# Altium schematic sheet Control.SchDoc
size A3
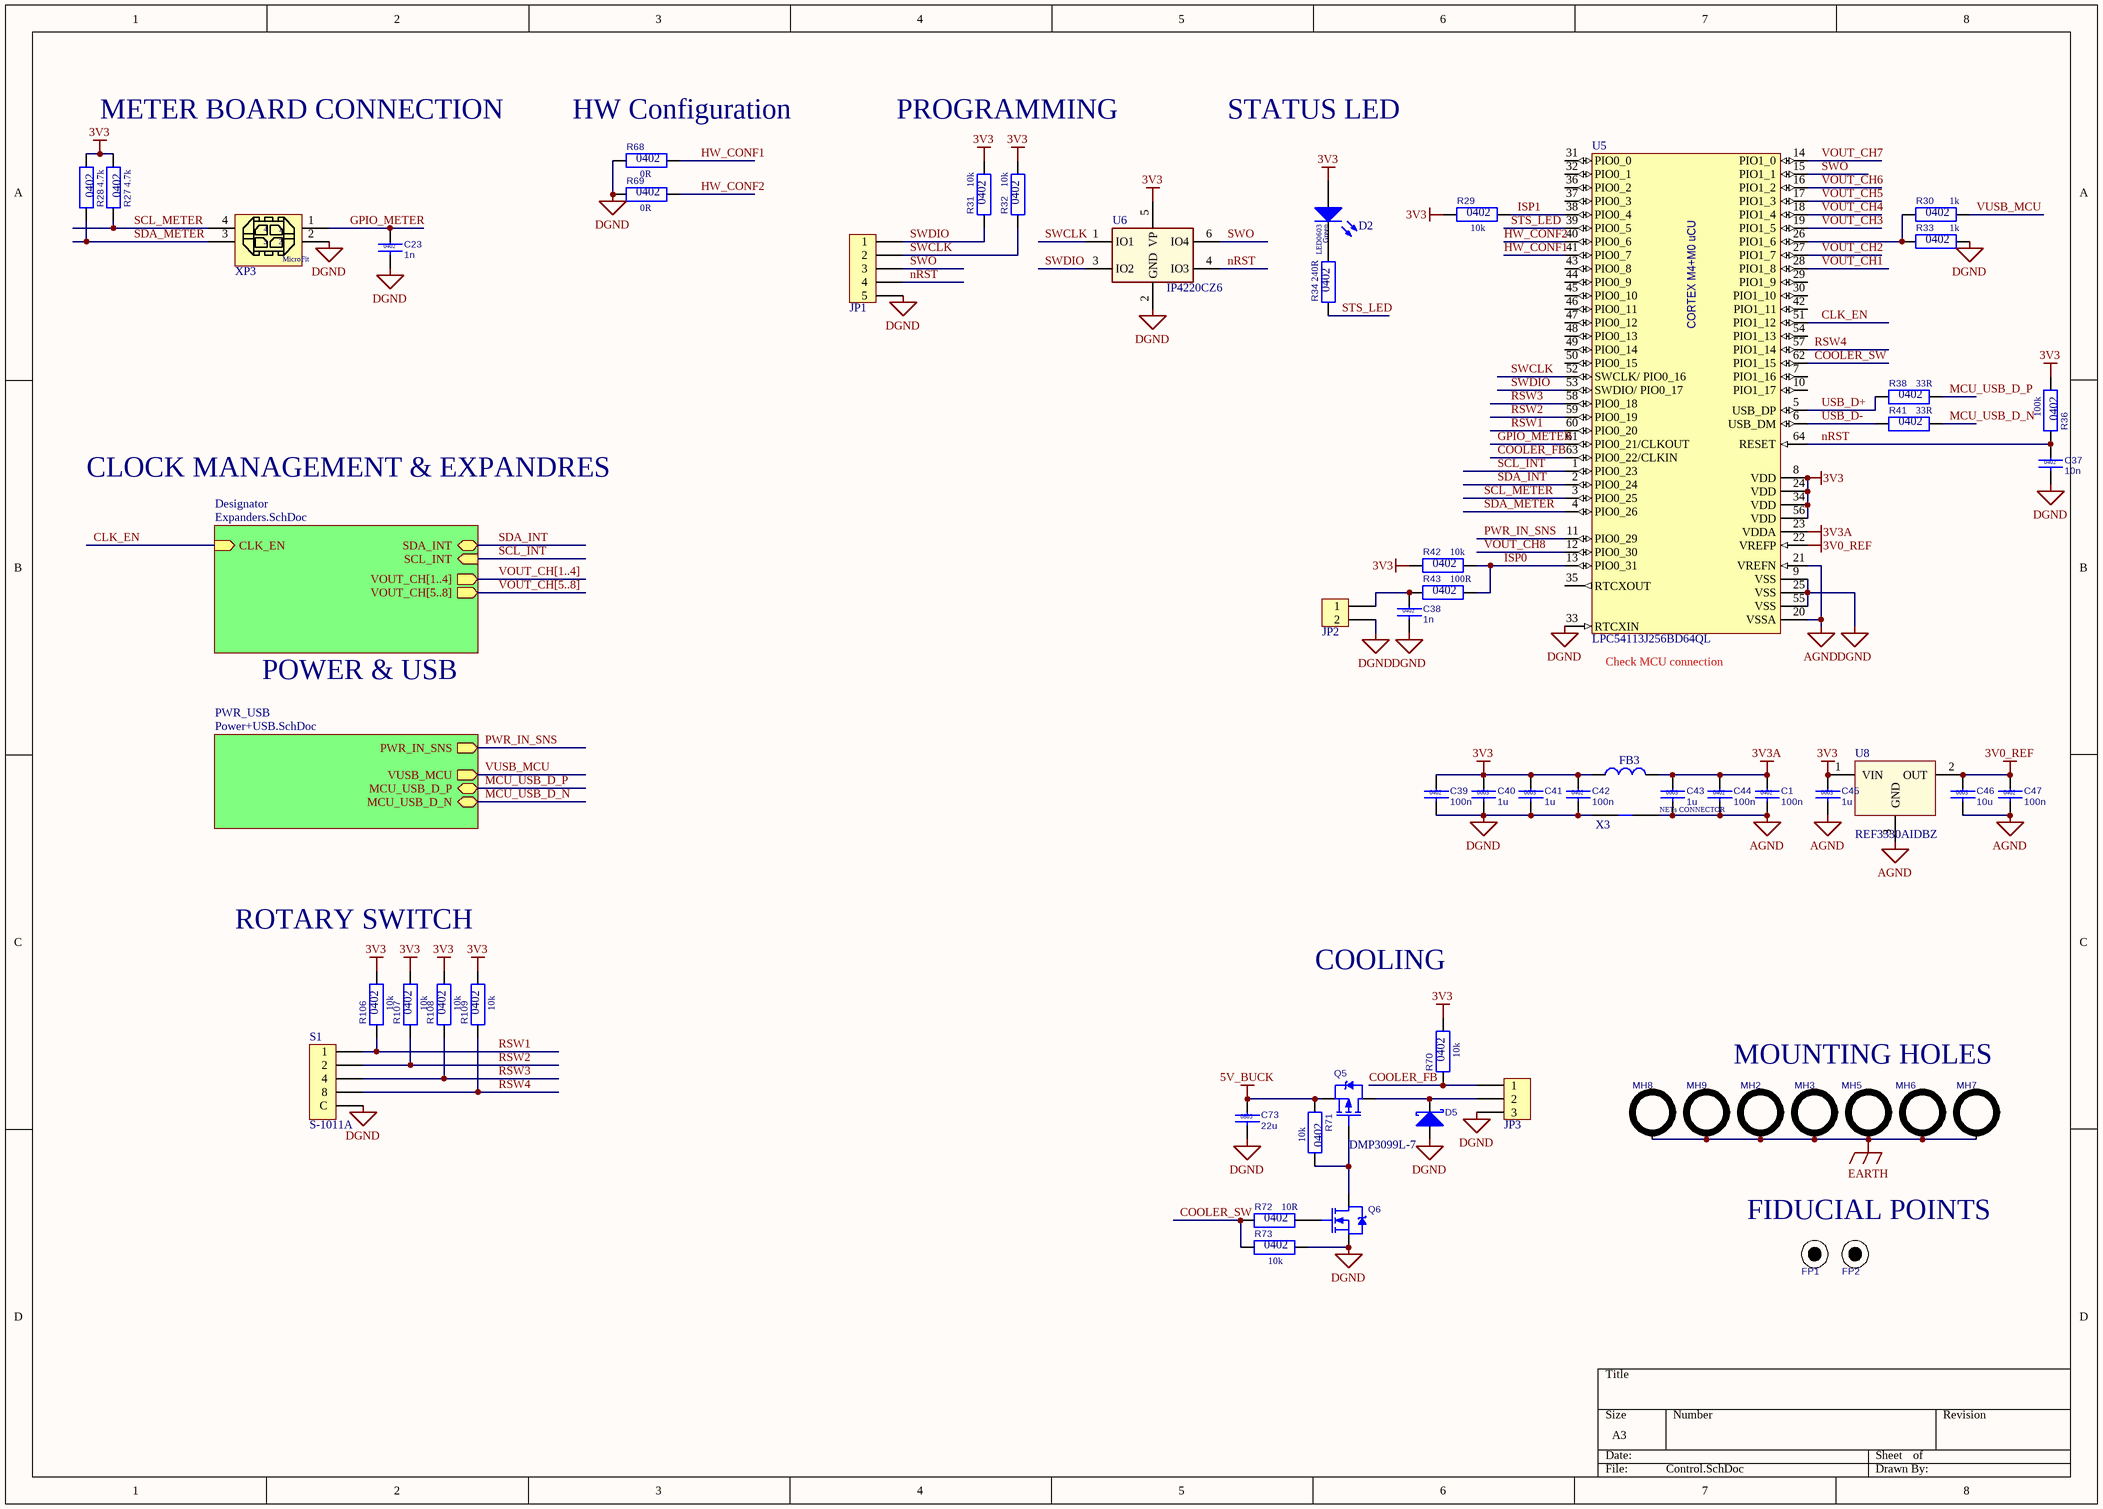
[diagram p0: Control.SchDoc]

## Parts
C1  100n  Case: 0402  [CC0402M]
C23  1n  Case: 0402  [CC0402M]
C37  10n  Case: 0402  [CC0402M]
C38  1n  Case: 0402  [CC0402M]
C39  100n  Case: 0402  [CC0402M]
C40  1u  Case: 0603  [CC0603M]
C41  1u  Case: 0603  [CC0603M]
C42  100n  Case: 0402  [CC0402M]
C43  1u  Case: 0603  [CC0603M]
C44  100n  Case: 0402  [CC0402M]
C45  1u  Case: 0603  [CC0603M]
C46  10u  Case: 0603  [CC0603M]
C47  100n  Case: 0402  [CC0402M]
C73  22u  Case: 0805  [CC0805M]
D2  Color: Green  [LED0603]  (hidden comment: 150060GS75000)
D5  BAT54HT1G  [SOD323]  (value not drawn)
FB3  BLM18HG102SN1D  [FB0603M]  (value not drawn)
FP1  FP  [FP]  (value not drawn)  (no BOM)
FP2  FP  [FP]  (value not drawn)  (no BOM)
JP1  HEADER-2.54-THR-1x5-MV  [HEADER-2.54-THR-1x5-MV]  (value not drawn)
JP2  HEADER-2.54-THR-1x2-MV  [HEADER-2.54-THR-1x2-MV]  (value not drawn)
JP3  HEADER-2.54-THR-1x3-MV  [HEADER-2.54-THR-1x3-MV]  (value not drawn)
MH2  MH-3.5-PLATED  [MH_3.5_PLATED]  (value not drawn)  (no BOM)
MH3  MH-3.5-PLATED  [MH_3.5_PLATED]  (value not drawn)  (no BOM)
MH5  MH-3.5-PLATED  [MH_3.5_PLATED]  (value not drawn)  (no BOM)
MH6  MH-3.5-PLATED  [MH_3.5_PLATED]  (value not drawn)  (no BOM)
MH7  MH-3.5-PLATED  [MH_3.5_PLATED]  (value not drawn)  (no BOM)
MH8  MH-3.5-PLATED  [MH_3.5_PLATED]  (value not drawn)  (no BOM)
MH9  MH-3.5-PLATED  [MH_3.5_PLATED]  (value not drawn)  (no BOM)
Q5  DMP3099L-7  [SOT23-3]
Q6  NX3020NAKW,115  [SOT323]  (value not drawn)
R27  Case: 0402  [RC0402M]  (hidden comment: 4.7k)
R28  Case: 0402  [RC0402M]  (hidden comment: 4.7k)
R29  Case: 0402  [RC0402M]  (hidden comment: 10k)
R30  Case: 0402  [RC0402M]  (hidden comment: 1k)
R31  Case: 0402  [RC0402M]  (hidden comment: 10k)
R32  Case: 0402  [RC0402M]  (hidden comment: 10k)
R33  Case: 0402  [RC0402M]  (hidden comment: 1k)
R34  Case: 0402  [RC0402M]  (hidden comment: 240R)
R36  Case: 0402  [RC0402M]  (hidden comment: 100k)
R38  Case: 0402  [RC0402M]  (hidden comment: 33R)
R41  Case: 0402  [RC0402M]  (hidden comment: 33R)
R42  Case: 0402  [RC0402M]  (hidden comment: 10k)
R43  Case: 0402  [RC0402M]  (hidden comment: 100R)
R68  Case: 0402  [RC0402M]  (hidden comment: 0R)
R69  Case: 0402  [RC0402M]  (hidden comment: 0R)
R70  Case: 0402  [RC0402M]  (hidden comment: 10k)
R71  Case: 0402  [RC0402M]  (hidden comment: 10k)
R72  Case: 0402  [RC0402M]  (hidden comment: 10R)
R73  Case: 0402  [RC0402M]  (hidden comment: 10k)
R106  Case: 0402  [RC0402M]  (hidden comment: 10k)
R107  Case: 0402  [RC0402M]  (hidden comment: 10k)
R108  Case: 0402  [RC0402M]  (hidden comment: 10k)
R109  Case: 0402  [RC0402M]  (hidden comment: 10k)
S1  S-1011A  [S-1011A]
U5  LPC54113J256BD64QL  [LQFP-64]
U6  IP4220CZ6  [TSOP-6]
U8  REF3330AIDBZ  [SOT23-3]
X3  NETs_CONNECTOR  [NETs_CONNECTOR]  (value not drawn)  (no BOM)
XP3  0447690401  [0447690401]  (value not drawn)

## Sub-sheets
Designator = Expanders.SchDoc: SDA_INT (bidir), SCL_INT (in), VOUT_CH[5..8] (out), CLK_EN (in), VOUT_CH[1..4] (out)
PWR_USB = Power+USB.SchDoc: PWR_IN_SNS (out), MCU_USB_D_N (bidir), MCU_USB_D_P (bidir), VUSB_MCU (out)

## Nets
3V0_REF: C46.1 C47.1 U5.22(VREFP) U8.2(OUT)
3V3: C39.1 C40.1 C41.1 C42.1 C45.1 D2.2(A) FB3.1 R27.2 R28.2 R29.1 R31.2 R32.2 R36.2 R42.1 R70.2 R106.2 R107.2 R108.2 R109.2 U5.8(VDD) U5.24(VDD) U5.34(VDD) U5.56(VDD) U6.5(VP) U8.1(VIN)
3V3A: C1.1 C43.1 C44.1 FB3.2 U5.23(VDDA)
5V_BUCK: C73.1 Q5.2(S) R71.1
AGND: C1.2 C43.2 C44.2 C45.2 C46.2 C47.2 U5.20(VSSA) U5.21(VREFN) U8.3(GND) X3.1
DGND: C23.2 C37.2 C38.2 C39.2 C40.2 C41.2 C42.2 C73.2 D5.2(A) JP1.5 JP2.2 JP3.3 Q6.2(S) R33.2 R68.1 R69.1 R73.2 S1.C U5.9(VSS) U5.25(VSS) U5.33(RTCXIN) U5.55(VSS) U6.2(GND) X3.2 XP3.2
EARTH: MH2.0 MH3.0 MH5.0 MH6.0 MH7.0 MH8.0 MH9.0
CLK_EN: U5.51(PIO1_12) ; sheet Designator/CLK_EN
COOLER_FB: JP3.1 R70.1 U5.63(PIO0_22/CLKIN)
COOLER_SW: R72.1 R73.1 U5.62(PIO1_15)
GPIO_METER: C23.1 U5.61(PIO0_21/CLKOUT) XP3.1
HW_CONF1: R68.2 U5.41(PIO0_7)
HW_CONF2: R69.2 U5.40(PIO0_6)
ISP0: R42.2 R43.2 U5.13(PIO0_31)
ISP1: R29.2 U5.38(PIO0_4)
MCU_USB_D_N: R41.2 ; sheet PWR_USB/MCU_USB_D_N
MCU_USB_D_P: R38.2 ; sheet PWR_USB/MCU_USB_D_P
nRST: C37.1 JP1.4 R36.1 U5.64(RESET) U6.4(IO3)
PWR_IN_SNS: U5.11(PIO0_29) ; sheet PWR_USB/PWR_IN_SNS
RSW1: R106.1 S1.1 U5.60(PIO0_20)
RSW2: R107.1 S1.2 U5.59(PIO0_19)
RSW3: R108.1 S1.4 U5.58(PIO0_18)
RSW4: R109.1 S1.8 U5.57(PIO1_14)
SCL_INT: U5.1(PIO0_23) ; sheet Designator/SCL_INT
SCL_METER: R27.1 U5.3(PIO0_25) XP3.4
SDA_INT: U5.2(PIO0_24) ; sheet Designator/SDA_INT
SDA_METER: R28.1 U5.4(PIO0_26) XP3.3
STS_LED: R34.1 U5.39(PIO0_5)
SWCLK: JP1.2 R32.1 U5.52(SWCLK/_PIO0_16) U6.1(IO1)
SWDIO: JP1.1 R31.1 U5.53(SWDIO/_PIO0_17) U6.3(IO2)
SWO: JP1.3 U5.15(PIO1_1) U6.6(IO4)
USB_D+: R38.1 U5.5(USB_DP)
USB_D-: R41.1 U5.6(USB_DM)
VOUT_CH1: U5.28(PIO1_8)
VOUT_CH2: U5.27(PIO1_7)
VOUT_CH3: U5.19(PIO1_5)
VOUT_CH4: U5.18(PIO1_4)
VOUT_CH5: U5.17(PIO1_3)
VOUT_CH6: U5.16(PIO1_2)
VOUT_CH7: U5.14(PIO1_0)
VOUT_CH8: U5.12(PIO0_30)
VUSB_MCU: R30.2 ; sheet PWR_USB/VUSB_MCU
NetC38_1: C38.1 JP2.1 R43.1
NetD2_1: D2.1(K) R34.2
NetD5_1: D5.1(K) JP3.2 Q5.3(D)
NetQ5_1: Q5.1(G) Q6.3(D) R71.2
NetQ6_1: Q6.1(G) R72.2
NetR30_1: R30.1 R33.1 U5.26(PIO1_6)

Not connected (* = marked no-connect by the designer): U5 7(PIO1_16) 10(PIO1_17) 29(PIO1_9) 30(PIO1_10) 31(PIO0_0) 32(PIO0_1) 35(RTCXOUT) 36(PIO0_2) 37(PIO0_3) 42(PIO1_11) 43(PIO0_8) 44(PIO0_9) 45(PIO0_10) 46(PIO0_11) 47(PIO0_12) 48(PIO0_13) 49(PIO0_14) 50(PIO0_15) 54(PIO1_13)

## Buses and harness runs
bus VOUT_CH[1..4] = sheet Designator/VOUT_CH[1..4]
bus VOUT_CH[5..8] = sheet Designator/VOUT_CH[5..8]

## Notes on the sheet
- METER BOARD CONNECTION
- (near R68) HW Configuration
- PROGRAMMING
- STATUS LED
- CLOCK MANAGEMENT & EXPANDRES
- POWER & USB
- (near U5) Check MCU connection
- ROTARY SWITCH
- COOLING
- MOUNTING HOLES
- FIDUCIAL POINTS
- (in symbol 0447690401) MicroFit
- (in symbol LPC54113J256BD64QL) CORTEX M4+M0 uCU
- (in symbol NETs_CONNECTOR) NETs CONNECTOR

## Library data of the parts
C1 C39 C42 C44 C47 = CC0402K-X7R-25V-100N-M: Chip ceramic capacitor; Manufacturer PN: GRM155R71E104KE14J; Manufacturer: Murata; Tollerance: 10%; Rated Voltage: 25V; Material: X7R; PartNumber: CC0402K-X7R-25V-100N-M; Value: 100n; Publisher: alexey.savchenko; Publishing Date: 1/12/2020
C23 C38 = CC0402K-X7R-50V-1N-M: Chip ceramic capacitor; Manufacturer PN: CC0402KRX7R9BB102; Manufacturer: Yageo; Tollerance: 10%; Rated Voltage: 50V; Material: X7R; PartNumber: CC0402K-X7R-50V-1N-M; Value: 1n; Publisher: alexey.savchenko; Publishing Date: 2/27/2020
C37 = CC0402K-X7R-50V-10N-M: Chip ceramic capacitor; Manufacturer PN: CC0402KRX7R9BB103; Manufacturer: Yageo; Tollerance: 10%; Rated Voltage: 50V; Material: X7R; PartNumber: CC0402K-X7R-50V-10N-M; Value: 10n; Publisher: alexey.savchenko; Publishing Date: 2/27/2020
C40 C41 C43 C45 = CC0603K-X7R-10V-1U-M: Chip ceramic capacitor; Manufacturer PN: CL10B105KP8NNNC; Manufacturer: Samsung; Tollerance: 10%; Rated Voltage: 10V; Material: X5R; PartNumber: CC0603K-X7R-10V-1U-M; Value: 1u; Publisher: alexey.savchenko; Publishing Date: 1/12/2020
C46 = CC0603K-X5R-10V-10U-M: Chip ceramic capacitor; Manufacturer PN: GRM188R61A106KE69D; Manufacturer: Murata; Tollerance: 10%; Rated Voltage: 10V; Material: X5R; PartNumber: CC0603K-X5R-10V-10U-M; Value: 10u; Publisher: alexey.savchenko; Publishing Date: 1/12/2020
C73 = CC0805K-X5R-10V-22U-M: Chip ceramic capacitor; Manufacturer PN: CL21A226KPCLRNC; Manufacturer: Samsung; Tollerance: 10%; Rated Voltage: 10V; Material: X5R; PartNumber: CC0805K-X5R-10V-22U-M; Value: 22u; Publisher: alexey.savchenko; Publishing Date: 2/17/2020
D2 = 150060GS75000: LED GREEN CLEAR 0603 SMD; Manufacturer: Würth Elektronik; Case: LED0603; PartNumber: 150060GS75000; Manufacturer PN: 150060GS75000; Publisher: alexey.savchenko; Publishing Date: 1/27/2020
D5 = BAT54HT1G: DIODE SCHOTTKY 30V 200MA SOD323; Manufacturer: ON Semiconductor; PartNumber: BAT54HT1G; Manufacturer PN: BAT54HT1G; Case: SOD323; Publisher: alexey.savchenko; Publishing Date: 2/17/2020
FB3 = BLM18HG102SN1D: FERRITE BEAD 1 KOHM 0603 1LN; Manufacturer: Murata; Resistance: 1000; PartNumber: BLM18HG102SN1D; Manufacturer PN: BLM18HG102SN1D; Publisher: alexey.savchenko; Publishing Date: 1/12/2020
FP1 FP2 = FP: No BOM component to short circuit 2 nets; Manufacturer PN: NULL; PartNumber: FP; Manufacturer: NULL; Publisher: alexey.savchenko; Publishing Date: 2/14/2020
JP1 = HEADER-2.54-THR-1x5-MV: Header Connector, 2.54mm pitch, Single, 5 contacts, Male, Vertical; Manufacturer PN: PH1-05-UA; Manufacturer: Adam Tech; PartNumber: HEADER-2.54-THR-1x5-MV; Publisher: alexey.savchenko; Publishing Date: 1/24/2020
JP2 = HEADER-2.54-THR-1x2-MV: Header Connector, 2.54mm pitch, Single, 2 contacts, Male, Vertical; Manufacturer PN: PH1-02-UA; Manufacturer: Adam Tech; PartNumber: HEADER-2.54-THR-1x2-MV; Publisher: alexey.savchenko; Publishing Date: 1/24/2020
JP3 = HEADER-2.54-THR-1x3-MV: Header Connector, 2.54mm pitch, Single, 3 contacts, Male, Vertical; Manufacturer PN: PH1-03-UA; Manufacturer: Adam Tech; PartNumber: HEADER-2.54-THR-1x3-MV; Publisher: alexey.savchenko; Publishing Date: 1/24/2020
MH2 MH3 MH5-MH9 = MH-3.5-PLATED: Mounting Hole; Manufacturer PN: NULL; PartNumber: MH-3.5-PLATED; Manufacturer: NULL; Publisher: alexey.savchenko; Publishing Date: 3/25/2020
Q5 = DMP3099L-7: P-Channel 30V 3.8A (Ta) 1.08W (Ta) Surface Mount SOT-23; Manufacturer: Diodes; PartNumber: DMP3099L-7; Manufacturer PN: DMP3099L-7; Case: SOT23-3; Publisher: alexey.savchenko; Publishing Date: 2/26/2020
Q6 = NX3020NAKW,115: MOSFET N-CH 30V 180MA SOT323; Manufacturer: Nexperia; Analogs: DMN63D8LW-7; PartNumber: NX3020NAKW,115; Manufacturer PN: NX3020NAKW,115; Case: SOT323; Publisher: alexey.savchenko; Publishing Date: 2/17/2020
R27 R28 = RC0402F-4K7-M: Chip resistor; Manufacturer PN: RC0402FR-074K7L; Manufacturer: Yageo; Tollerance: 1%; Rated Voltage: 50V; Power: 0.063W; T Coefficient: 100ppm; Value: 4.7k; PartNumber: RC0402F-4K7-M; Publisher: alexey.savchenko; Publishing Date: 2/24/2020
R29 R31 R32 R42 R70 R71 R73 R106-R109 = RC0402F-10K-M: Chip resistor; Manufacturer PN: RC0402FR-0710KL; Manufacturer: Yageo; Tollerance: 1%; Rated Voltage: 50V; Power: 0.063W; T Coefficient: 100ppm; Value: 10k; PartNumber: RC0402F-10K-M; Publisher: alexey.savchenko; Publishing Date: 2/24/2020
R30 R33 = RC0402F-1K-M: Chip resistor; Manufacturer PN: RC0402FR-071KL; Manufacturer: Yageo; Tollerance: 1%; Rated Voltage: 50V; Power: 0.063W; T Coefficient: 100ppm; Value: 1k; PartNumber: RC0402F-1K-M; Publisher: alexey.savchenko; Publishing Date: 2/24/2020
R34 = RC0402F-240R-M: Chip resistor; Manufacturer PN: RC0402FR-07240RL; Manufacturer: Yageo; Tollerance: 1%; Rated Voltage: 50V; Power: 0.063W; Value: 240R; PartNumber: RC0402F-240R-M; Publisher: alexey.savchenko; Publishing Date: 2/24/2020
R36 = RC0402F-100K-M: Chip resistor; Manufacturer PN: RC0402FR-07100KL; Manufacturer: Yageo; Tollerance: 1%; Rated Voltage: 50V; Power: 0.063W; T Coefficient: 100ppm; Value: 100k; PartNumber: RC0402F-100K-M; Publisher: alexey.savchenko; Publishing Date: 2/24/2020
R38 R41 = RC0402F-33R-M: Chip resistor; Manufacturer PN: RC0402FR-0733RL; Manufacturer: Yageo; Tollerance: 1%; Rated Voltage: 50V; Power: 0.063W; Value: 33R; PartNumber: RC0402F-33R-M; Publisher: alexey.savchenko; Publishing Date: 2/24/2020
R43 = RC0402F-100R-M: Chip resistor; Manufacturer PN: RC0402FR-07100RL; Manufacturer: Yageo; Tollerance: 1%; Rated Voltage: 50V; Power: 0.063W; Value: 100R; PartNumber: RC0402F-100R-M; Publisher: alexey.savchenko; Publishing Date: 2/24/2020
R68 R69 = RC0402F-0R-M: Chip resistor; Manufacturer PN: RC0402FR-070RL; Manufacturer: Yageo; Tollerance: 1%; Rated Voltage: 50V; Power: 0.063W; Value: 0R; PartNumber: RC0402F-0R-M; Publisher: alexey.savchenko; Publishing Date: 2/24/2020
R72 = RC0402F-10R-M: Chip resistor; Manufacturer PN: RC0402FR-0710RL; Manufacturer: Yageo; Tollerance: 1%; Rated Voltage: 50V; Power: 0.063W; Value: 10R; PartNumber: RC0402F-10R-M; Publisher: alexey.savchenko; Publishing Date: 2/24/2020
S1 = S-1011A: Dip Switch Hexadecimal 16 Position Through Hole, Right Angle Rotary for Tool Actuator 100mA 5VDC; Manufacturer PN: DSC6001CI2A-004.0000S-1011A; Manufacturer: Nidec Copal Electronics; PartNumber: S-1011A; Publisher: alexey.savchenko; Publishing Date: 4/17/2020
U5 = LPC54113J256BD64QL: IC MCU 32BIT 256KB FLASH 64LQFP; Manufacturer: NXP; PartNumber: LPC54113J256BD64QL; Manufacturer PN: LPC54113J256BD64QL; Case: LQFP-64; Publisher: alexey.savchenko; Publishing Date: 1/24/2020
U6 = IP4220CZ6: TVS DIODE 5.5V 6TSOP; Manufacturer: Nexperia; PartNumber: IP4220CZ6; Manufacturer PN: IP4220CZ6; Case: TSOP-6; Publisher: alexey.savchenko; Publishing Date: 1/24/2020
U8 = REF3330AIDBZ: IC VREF SERIES 0.15% SOT23-3; Manufacturer: TI; PartNumber: REF3330AIDBZ; Manufacturer PN: REF3330AIDBZ; Case: SOT23-3; Publisher: alexey.savchenko; Publishing Date: 2/19/2020
X3 = NETs_CONNECTOR: No BOM component to short circuit 2 nets; Manufacturer PN: NULL; PartNumber: NETs_CONNECTOR; Manufacturer: NULL; Publisher: alexey.savchenko; Publishing Date: 2/14/2020
XP3 = 0447690401: Micro-Fit BMI Receptacle Header, Dual Row, Vertical, with Press-fit Plastic Pegs, 2.54µm Tin (Sn), 4 Circuits; Manufacturer: Molex; Analogs: 0447690402, 0447690403; PartNumber: 0447690401; Manufacturer PN: 0447690401; Publisher: alexey.savchenko; Publishing Date: 2/14/2020